# Altium schematic sheet Gateway.SchDoc
size A4; SheetNumber: 2; SheetTotal: 4; SPICEModelCacheGQHKZIII: <root> / <DocumentId>GQHKZIII</DocumentId> / </root>
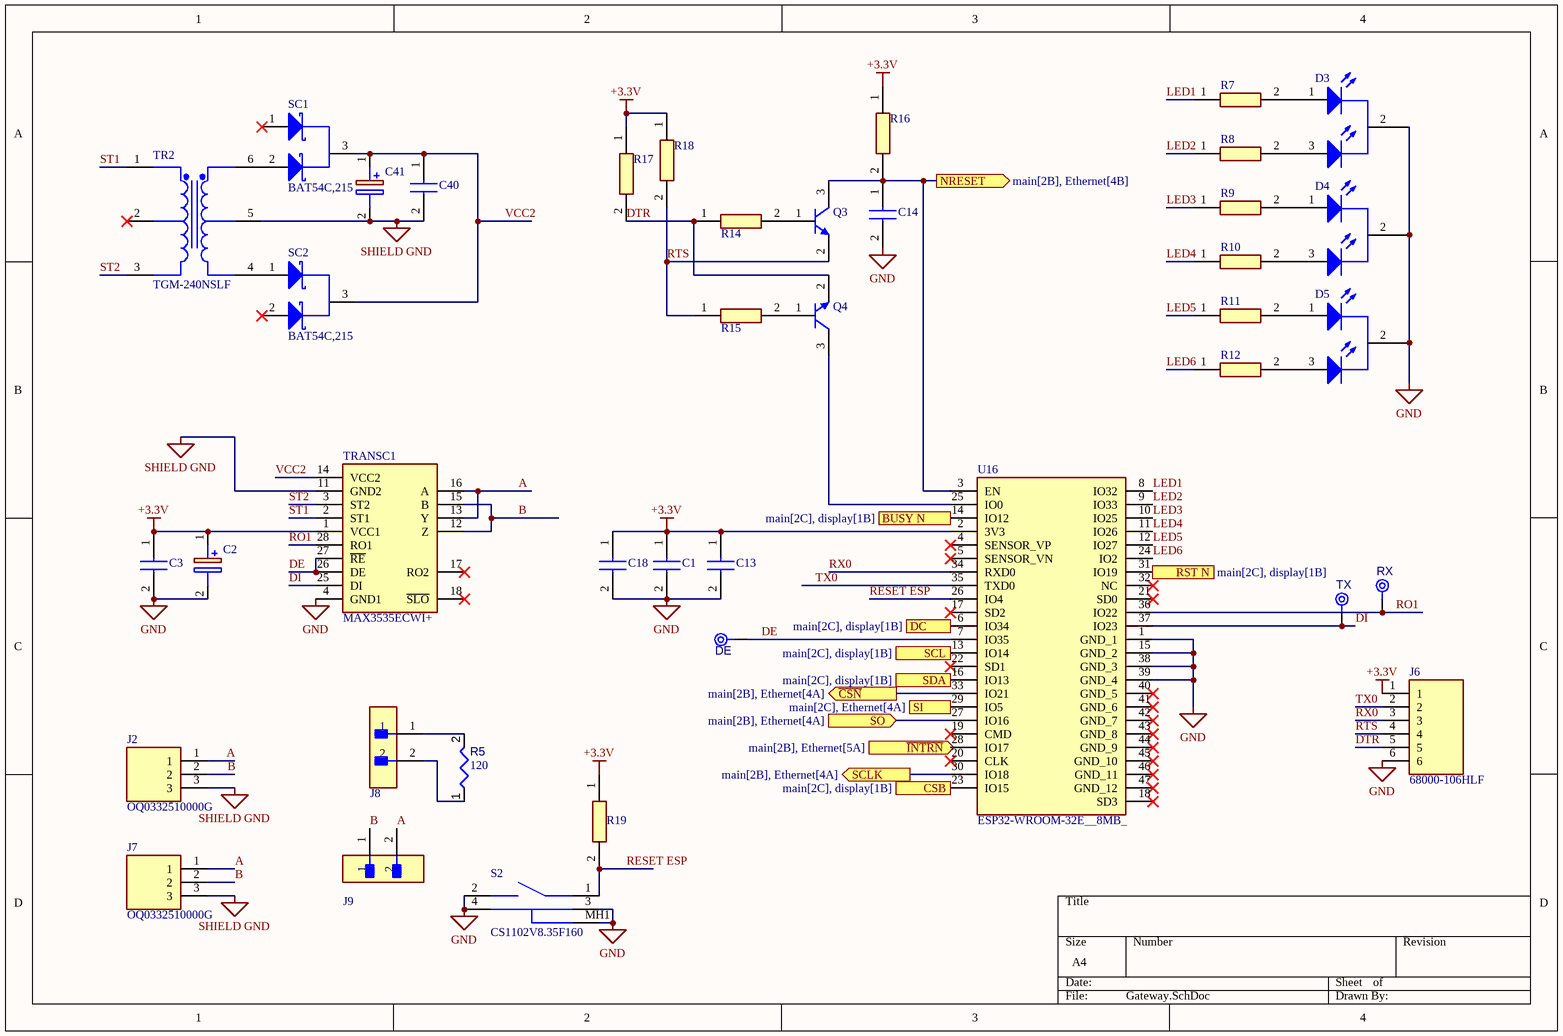
[diagram p0: Gateway.SchDoc]

## Parts
C1  C1005X7R1C104KT  [CAPC1005X55N]  (value not drawn)
C2  EDH106M016A9BAA  [CAPAE430X565N]  (value not drawn)
C3  C1005X7R1C104KT  [CAPC1005X55N]  (value not drawn)
C13  CL05A106MP8NUB8  [CAPC1005X90N]  (value not drawn)
C14  CL05A106MP8NUB8  [CAPC1005X90N]  (value not drawn)
C18  CL05B103KO5NNNC  [CAPC1005X55N]  (value not drawn)
C40  C1005X7R1C104KT  [CAPC1005X55N]  (value not drawn)
C41  EDH106M016A9BAA  [CAPAE430X565N]  (value not drawn)
D3  LTL1BEKVJNN  [Lite-On_Inc._LTL1BEKVJNN_0]  (value not drawn)
D4  LTL1BEKVJNN  [Lite-On_Inc._LTL1BEKVJNN_0]  (value not drawn)
D5  LTL1BEKVJNN  [Lite-On_Inc._LTL1BEKVJNN_0]  (value not drawn)
DE  TPAD6R  [TP06R]  (value not drawn)  (no BOM)
J2  OQ0332510000G  [SHDRRA3W80P0X381_1X3_1262X920X720P]
J6  68000-106HLF  [HDRV6W50P0X200_1X6_1200X200X530P]
J7  OQ0332510000G  [SHDRRA3W80P0X381_1X3_1262X920X720P]
J8  68000-102HLF  [Amphenol_ICC_-_FCI_0_MFG]  (value not drawn)
J9  68000-102HLF  [Amphenol_ICC_-_FCI_0_MFG]  (value not drawn)
Q3  MMBT2222ALT1G  [SOT96P237X111-3N]  (value not drawn)
Q4  MMBT2222ALT1G  [SOT96P237X111-3N]  (value not drawn)
R5  value 120  [RESC0805(2012)_L]  (hidden comment: RT0805FRE13120RL)
R7  RC0402FR-071KL  [RESC1005X40N]  (value not drawn)
R8  RC0402FR-071KL  [RESC1005X40N]  (value not drawn)
R9  RC0402FR-071KL  [RESC1005X40N]  (value not drawn)
R10  RC0402FR-071KL  [RESC1005X40N]  (value not drawn)
R11  RC0402FR-071KL  [RESC1005X40N]  (value not drawn)
R12  RC0402FR-071KL  [RESC1005X40N]  (value not drawn)
R14  RC0402FR-0710KL  [RESC1005X40N]  (value not drawn)
R15  RC0402FR-0710KL  [RESC1005X40N]  (value not drawn)
R16  RC0402FR-0710KL  [RESC1005X40N]  (value not drawn)
R17  RC0402FR-0710KL  [RESC1005X40N]  (value not drawn)
R18  RC0402FR-0710KL  [RESC1005X40N]  (value not drawn)
R19  RC0402FR-0710KL  [RESC1005X40N]  (value not drawn)
RX  TPAD6R  [TP06R]  (value not drawn)  (no BOM)
S2  CS1102V8.35F160  [CS1102V385F260]
SC1  BAT54C,215  [BAT54C215]
SC2  BAT54C,215  [BAT54C215]
TR2  TGM-240NSLF  [TGM240NSLF]
TRANSC1  MAX3535ECWI+  [MAX3535ECWI]
TX  TPAD6R  [TP06R]  (value not drawn)  (no BOM)
U16  ESP32-WROOM-32E__8MB_  [ESP32WROOM32E8MB]

## Ports
BUSY N (out, see main[2C], display[1B]), CSB (out, see main[2C], display[1B]), DC (out, see main[2C], display[1B]), NRESET (out, see main[2B], Ethernet[4B]), RST N (out, see main[2C], display[1B]), SCL (out, see main[2C], display[1B]), SCLK (out, see main[2B], Ethernet[4A]), SDA (out, see main[2C], display[1B]), SI (out, see main[2C], Ethernet[4A]), SO (in, see main[2B], Ethernet[4A]), ~{CSN} (out, see main[2B], Ethernet[4A]), ~{INTRN} (in, see main[2B], Ethernet[5A])

## Nets
+3.3V: C1.1 C2.1(+) C3.1 C13.1 C18.1 J6.1 R16.1 R17.1 R18.1 R19.1 TRANSC1.1(VCC1) U16.2(3V3)
GND: C1.2 C2.2(-) C3.2 C13.2 C14.2 C18.2 D3.2(COMMONCATHODE) D4.2(COMMONCATHODE) D5.2(COMMONCATHODE) J6.6 S2.2(COM) S2.3(GND_1) S2.4(GND_2) S2.MH1 TRANSC1.4(GND1) U16.1(GND_1) U16.15(GND_2) U16.38(GND_3) U16.39(GND_4)
SHIELD GND: C40.2 C41.2(-) J2.3 J7.3 TR2.5(SEC_2) TRANSC1.11(GND2)
~{CSN}: U16.33(IO21) ; port ~{CSN}
~{INTRN}: U16.28(IO17) ; port ~{INTRN}
A: J2.1 J7.1 J9.2 TRANSC1.13(Y) TRANSC1.16(A)
B: J2.2 J7.2 J9.1 TRANSC1.12(Z) TRANSC1.15(B)
BUSY N: U16.14(IO12) ; port BUSY N
CSB: U16.23(IO15) ; port CSB
DC: U16.6(IO34) ; port DC
DE: DE.1(TP) TRANSC1.26(DE) TRANSC1.27(~{RE}) U16.7(IO35)
DI: TRANSC1.25(DI) TX.1(TP) U16.37(IO23)
DTR: J6.5 Q4.2(E) R14.1 R17.2
LED1: R7.1 U16.8(IO32)
LED2: R8.1 U16.9(IO33)
LED3: R9.1 U16.10(IO25)
LED4: R10.1 U16.11(IO26)
LED5: R11.1 U16.12(IO27)
LED6: R12.1 U16.24(IO2)
NRESET: C14.1 Q3.3(C) R16.2 U16.3(EN) ; port NRESET
RESET ESP: R19.2 S2.1(NO) U16.26(IO4)
RO1: RX.1(TP) TRANSC1.28(RO1) U16.36(IO22)
RST N: U16.31(IO19) ; port RST N
RTS: J6.4 Q3.2(E) R15.1 R18.2
RX0: J6.3 U16.34(RXD0)
SCL: U16.13(IO14) ; port SCL
SCLK: U16.30(IO18) ; port SCLK
SDA: U16.16(IO13) ; port SDA
SI: U16.29(IO5) ; port SI
SO: U16.27(IO16) ; port SO
ST1: TR2.1(PRI_1) TRANSC1.2(ST1)
ST2: TR2.3(PRI_3) TRANSC1.3(ST2)
TX0: J6.2 U16.35(TXD0)
VCC2: C40.1 C41.1(+) SC1.3(COMMON_CATHODE) SC2.3(COMMON_CATHODE) TRANSC1.14(VCC2)
NetD3_1: D3.1(REDANODE) R7.2
NetD3_3: D3.3(GREENANODE) R8.2
NetD4_1: D4.1(REDANODE) R9.2
NetD4_3: D4.3(GREENANODE) R10.2
NetD5_1: D5.1(REDANODE) R11.2
NetD5_3: D5.3(GREENANODE) R12.2
NetJ8_1: J8.1 R5.2
NetJ8_2: J8.2 R5.1
NetQ3_1: Q3.1(B) R14.2
NetQ4_1: Q4.1(B) R15.2
NetQ4_3: Q4.3(C) U16.25(IO0)
NetSC1_2: SC1.2(ANODE_2) TR2.6(SEC_3)
NetSC2_1: SC2.1(ANODE_1) TR2.4(SEC_1)

Not connected (* = marked no-connect by the designer): SC1 1(ANODE_1)*; SC2 2(ANODE_2)*; TR2 2(PRI_2)*; TRANSC1 17(RO2)* 18(~{SLO})*; U16 4(SENSOR_VP)* 5(SENSOR_VN)* 17(SD2)* 18(SD3)* 19(CMD)* 20(CLK)* 21(SD0)* 22(SD1)* 32(NC)* 40(GND_5)* 41(GND_6)* 42(GND_7)* 43(GND_8)* 44(GND_9)* 45(GND_10)* 46(GND_11)* 47(GND_12)*

## Library data of the parts
C1 C3 C40 = C1005X7R1C104KT: Capacitor 100n; Manufacturer_Name: TDK; Datasheet Link: https://product.tdk.com/en/system/files?file=dam/doc/product/capacitor/ceramic/mlcc/specification/mlccspec_commercial_general_midvoltage_en.pdf; Height: 0.55mm; Manufacturer_Part_Number: C1005X7R1C104KT; Mouser Part Number: N/A; Mouser Price/Stock: https://www.mouser.co.uk/ProductDetail/TDK/C1005X7R1C104KT?qs=cdpe0LUyr8DJnVp5QbU7dQ%3D%3D
C2 C41 = EDH106M016A9BAA: Capacitor Polarised 10u; Manufacturer_Name: KEMET; Datasheet Link: https://content.kemet.com/datasheets/KEM_A4049_EDH.pdf; Height: 5.65mm; Manufacturer_Part_Number: EDH106M016A9BAA; Mouser Part Number: 80-EDH106M016A9BAA; Mouser Price/Stock: https://www.mouser.co.uk/ProductDetail/KEMET/EDH106M016A9BAA?qs=iR2ablhfrmGRSCLQdrL4eg%3D%3D; Arrow Part Number: EDH106M016A9BAA; Arrow Price/Stock: https://www.arrow.com/en/products/edh106m016a9baa/kemet-corporation?utm_currency=USD&region=nac
C13 C14 = CL05A106MP8NUB8: Capacitor 10u; Manufacturer_Name: SAMSUNG; Datasheet Link: https://datasheet.datasheetarchive.com/originals/distributors/DKDS-19/372904.pdf; Height: 0.9mm; Manufacturer_Part_Number: CL05A106MP8NUB8; Mouser Part Number: 187-CL05A106MP8NUB8; Mouser Price/Stock: https://www.mouser.co.uk/ProductDetail/Samsung-Electro-Mechanics/CL05A106MP8NUB8?qs=W0yvOO0ixfHmpNLt1Po66A%3D%3D; Arrow Part Number: CL05A106MP8NUB8; Arrow Price/Stock: https://www.arrow.com/en/products/cl05a106mp8nub8/samsung-electro-mechanics?region=nac
C18 = CL05B103KO5NNNC: Capacitor 10n; Manufacturer_Name: SAMSUNG; Datasheet Link: https://mouser.componentsearchengine.com/Datasheets/2/CL05B103KO5NNNC.pdf; Height: 0.55mm; Manufacturer_Part_Number: CL05B103KO5NNNC; Mouser Part Number: N/A; Mouser Price/Stock: https://www.mouser.co.uk/ProductDetail/Samsung-Electro-Mechanics/CL05B103KO5NNNC?qs=349EhDEZ59r%252BGo7Nl8uX3w%3D%3D; Arrow Part Number: CL05B103KO5NNNC; Arrow Price/Stock: https://www.arrow.com/en/products/cl05b103ko5nnnc/samsung-electro-mechanics
D3-D5 = LTL1BEKVJNN: No Description Available; Mfr_Name: LITE-ON; Type: LED Indication; RefDes: RefDes
DE RX TX = CMP-00028-00002-2: 0.6mm round; Pins: 1
J2 J7 = OQ0332510000G: Connector; Manufacturer_Name: Amphenol; Datasheet Link: http://www.anytek.com.tw/UserUpFiles/20181018/_S_eBwgMo_mC.pdf; Height: 7.2mm; Manufacturer_Part_Number: OQ0332510000G; Mouser Part Number: 649-220110-D031A01LF; Mouser Price/Stock: https://www.mouser.co.uk/ProductDetail/Amphenol-Anytek/OQ0332510000G?qs=Mv7BduZupUi%2F0eMoAWjmEw%3D%3D; Arrow Part Number: OQ0332510000G; Arrow Price/Stock: https://www.arrow.com/en/products/oq0332510000g/amphenol?region=europe
J6 = M22-2010605: Connector; Manufacturer_Name: Harwin; Datasheet Link: https://cdn.harwin.com/pdfs/M22-201.pdf; Height: 5.3mm; Manufacturer_Part_Number: M22-2010605; Mouser Part Number: 855-M22-2010605; Mouser Price/Stock: https://www.mouser.co.uk/ProductDetail/Harwin/M22-2010605?qs=xxdqPuaJ%252Ba3QIpHIi29hTA%3D%3D
Q3 Q4 = MMBT2222ALT1G: Integrated Circuit; Manufacturer_Name: onsemi; Datasheet Link: http://www.onsemi.com/pub/Collateral/MMBT2222LT1-D.PDF; Height: 1.11mm; Manufacturer_Part_Number: MMBT2222ALT1G; Mouser Part Number: 863-MMBT2222ALT1G; Mouser Price/Stock: https://www.mouser.co.uk/ProductDetail/onsemi/MMBT2222ALT1G?qs=HVbQlW5zcXWwnD7Jokybqg%3D%3D; Arrow Part Number: MMBT2222ALT1G; Arrow Price/Stock: https://www.arrow.com/en/products/mmbt2222alt1g/on-semiconductor?utm_currency=USD&region=europe
R5 = CMP-009-00174-3: Chip Resistor 120 ohms +1%; Tolerance: 5%; Power: 125mW; Max Operating Temperature: 155°C; Case/Package: 0805; Min Operating Temperature: -55°C; Pins: 2
R7-R12 = RC0402FR-071KL: Resistor; Manufacturer_Name: YAGEO; Datasheet Link: https://componentsearchengine.com/Datasheets/2/RC0402FR-071KL.pdf; Height: 0.4mm; Manufacturer_Part_Number: RC0402FR-071KL; Mouser Part Number: 603-RC0402FR-071KL; Mouser Price/Stock: https://www.mouser.co.uk/ProductDetail/YAGEO/RC0402FR-071KL?qs=V1yeUXFNrknDEmWLmm5v6g%3D%3D; Arrow Part Number: RC0402FR-071KL; Arrow Price/Stock: null?region=nac
R14-R19 = RC0402FR-0710KL: Resistor 10K; Manufacturer_Name: YAGEO; Datasheet Link: https://componentsearchengine.com/Datasheets/2/RC0402FR-0710KL.pdf; Height: 0.4mm; Manufacturer_Part_Number: RC0402FR-0710KL; Mouser Part Number: 603-RC0402FR-0710KL; Mouser Price/Stock: https://www.mouser.co.uk/ProductDetail/YAGEO/RC0402FR-0710KL?qs=I1mnnYJTTsxUoNwrUsQExA%3D%3D; Arrow Part Number: RC0402FR-0710KL; Arrow Price/Stock: https://www.arrow.com/en/products/rc0402fr-0710kl/yageo?region=europe
S2 = CS1102V3.85F260: Switch; Manufacturer_Name: CIT Relay & Switch; Datasheet Link: https://www.citrelay.com/Catalog Pages/SwitchCatalog/CS1102V.pdf; Height: 7.5mm; Manufacturer_Part_Number: CS1102V3.85F260
SC1 SC2 = BAT54C,215: Schottky Diode; Manufacturer_Name: Nexperia; Datasheet Link: https://assets.nexperia.com/documents/data-sheet/BAT54_SER.pdf; Height: 1.1mm; Manufacturer_Part_Number: BAT54C,215; Mouser Part Number: 771-BAT54C-T/R; Mouser Price/Stock: https://www.mouser.co.uk/ProductDetail/Nexperia/BAT54C215?qs=me8TqzrmIYV5SKKt13YKQA%3D%3D; Arrow Part Number: BAT54C,215; Arrow Price/Stock: https://www.arrow.com/en/products/bat54c215/nexperia?region=europe
TR2 = TGM-240NSLF: Connector; Manufacturer_Name: Halo Electronics; Datasheet Link: https://componentsearchengine.com/Datasheets/1/TGM-240NSLF.pdf; Height: 5.08mm; Manufacturer_Part_Number: TGM-240NSLF; Mouser Part Number: 493-TGM-240NSLF; Mouser Price/Stock: https://www.mouser.co.uk/ProductDetail/HALO-Electronics/TGM-240NSLF?qs=8uu3sA0mUdvq2J2JpT2Sjg%3D%3D
TRANSC1 = MAX3535ECWI+: Integrated Circuit; Manufacturer_Name: Analog Devices; Datasheet Link: https://datasheets.maximintegrated.com/en/ds/MAX3535E-MXL1535E.pdf; Height: 2.65mm; Manufacturer_Part_Number: MAX3535ECWI+; Mouser Part Number: 700-MAX3535ECWI; Mouser Price/Stock: https://www.mouser.co.uk/ProductDetail/Analog-Devices-Maxim-Integrated/MAX3535ECWI%2b?qs=1THa7WoU59GttcgUwE66Fg%3D%3D
U16 = ESP32-WROOM-32E__8MB_: Integrated Circuit; Manufacturer_Name: Espressif Systems; Manufacturer_Part_Number: ESP32-WROOM-32E (8MB); Datasheet Link: https://www.espressif.com/sites/default/files/documentation/esp32-wroom-32_datasheet_en.pdf; Height: 3.2mm; Mouser Part Number: 356-ESP32WRM32E164PH; Mouser Price/Stock: https://www.mouser.co.uk/ProductDetail/Espressif-Systems/ESP32-WROOM-32E-8MB?qs=GBLSl2AkirsjshqvD9slKA%3D%3D